# Altium schematic sheet MMBT3904-E1_MMBT3904-E.schdoc
size 127 x 101 mm
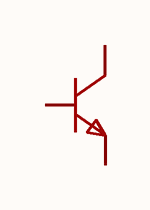
[diagram p0: MMBT3904-E1_MMBT3904-E.schdoc]

## Parts
Q?  MMBT3904-E  [SOT-23-3_L2.9-W1.4-P1.90-LS2.5-BR]  (value not drawn)

## Nets

Not connected (* = marked no-connect by the designer): Q? 1(B) 2(E) 3(C)

## Library data of the parts
Q? = MMBT3904-E: Manufacturer: MDD(辰达半导体); Add into BOM: yes; type: NPN; Current - Collector(Ic): 200mA; Collector - Emitter Voltage VCEO: 40V; Pd - Power Dissipation: 200mW; DC Current Gain: 300@10mA,1V; Transition frequency(fT): 300MHz; Current - Collector Cutoff: 100nA; Vce Saturation(VCE(sat)): 500mV@50mA,5mA; Emitter-Base Voltage(Vebo): 6V; Number: 1个NPN; Symbol: MMBT3904-E; Device: MMBT3904-E; LCSC Part Name: NPN 电流:200mA 电压:40V; Supplier Part: C41371422; Manufacturer Part: MMBT3904-E; Supplier Footprint: SOT-23; JLCPCB Part Class: Extended Part; Datasheet: https://item.szlcsc.com/datasheet/MMBT3904-E/43133593.html; Supplier: LCSC; Convert to PCB: yes